# Altium project PowerBoard.PrjPcb (part 2 of 2)

## Sheet ESC_B.SchDoc
size A3; SheetNumber: 8; SheetTotal: 10
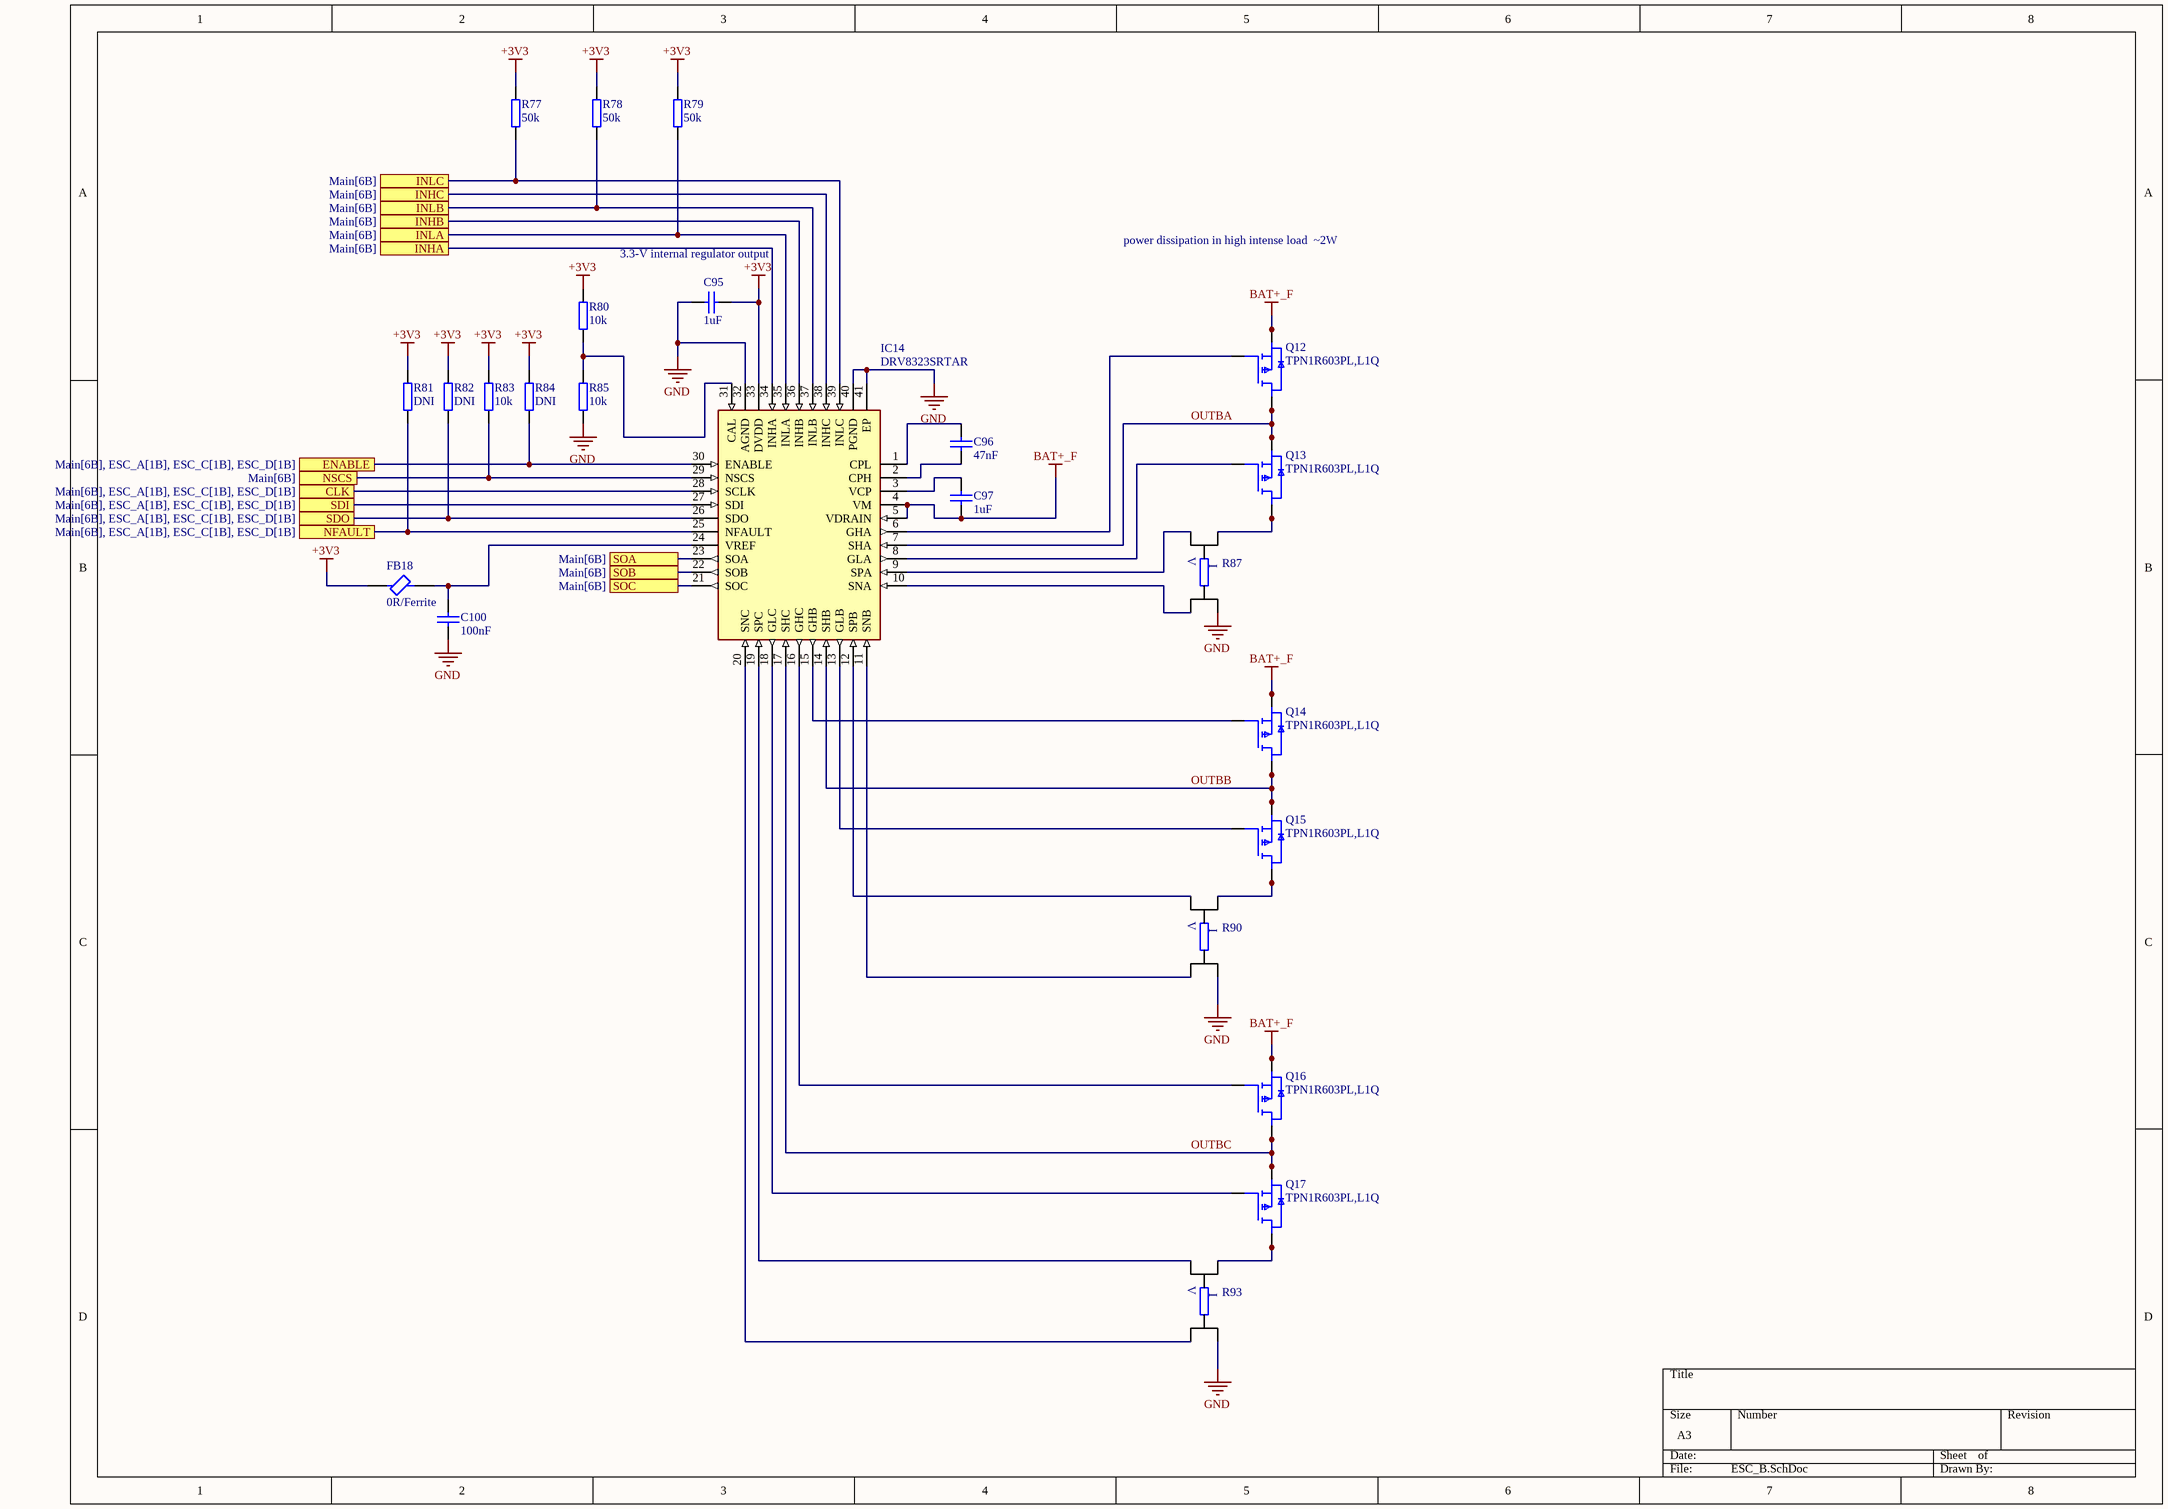
[diagram p8: ESC_B.SchDoc]

### Parts
C95  value 1uF  [CAP0402]  (hidden comment: Cap0402)
C96  value 47nF  [CAP0603]  (hidden comment: CapSMD0603)
C97  value 1uF  [CAP0603]  (hidden comment: CapSMD0603)
C100  value 100nF  [CAP0402]  (hidden comment: Cap0402)
FB18  0R/Ferrite  [NFZ15SG152SN10B]
IC14  DRV8323SRTAR  [QFN50P600X600X80-41N-D]
Q12  TPN1R603PL,L1Q  [TPN1R603PLL1Q]
Q13  TPN1R603PL,L1Q  [TPN1R603PLL1Q]
Q14  TPN1R603PL,L1Q  [TPN1R603PLL1Q]
Q15  TPN1R603PL,L1Q  [TPN1R603PLL1Q]
Q16  TPN1R603PL,L1Q  [TPN1R603PLL1Q]
Q17  TPN1R603PL,L1Q  [TPN1R603PLL1Q]
R77  value 50k  [RES0402]  (hidden comment: Res0402)
R78  value 50k  [RES0402]  (hidden comment: Res0402)
R79  value 50k  [RES0402]  (hidden comment: Res0402)
R80  value 10k  [RES0402]  (hidden comment: Res0402)
R81  value DNI  [RES0402]  (hidden comment: Res0402)
R82  value DNI  [RES0402]  (hidden comment: Res0402)
R83  value 10k  [RES0402]  (hidden comment: Res0402)
R84  value DNI  [RES0402]  (hidden comment: Res0402)
R85  value 10k  [RES0402]  (hidden comment: Res0402)
R87  WSK12161L000FEA  [WSK12161L000FEA]  (value not drawn)
R90  WSK12161L000FEA  [WSK12161L000FEA]  (value not drawn)
R93  WSK12161L000FEA  [WSK12161L000FEA]  (value not drawn)

### Ports
CLK (see Main[6B], ESC_A[1B], ESC_C[1B], ESC_D[1B]), ENABLE (see Main[6B], ESC_A[1B], ESC_C[1B], ESC_D[1B]), INHA (see Main[6B]), INHB (see Main[6B]), INHC (see Main[6B]), INLA (see Main[6B]), INLB (see Main[6B]), INLC (see Main[6B]), NFAULT (see Main[6B], ESC_A[1B], ESC_C[1B], ESC_D[1B]), NSCS (see Main[6B]), SDI (see Main[6B], ESC_A[1B], ESC_C[1B], ESC_D[1B]), SDO (see Main[6B], ESC_A[1B], ESC_C[1B], ESC_D[1B]), SOA (see Main[6B]), SOB (see Main[6B]), SOC (see Main[6B])

### Nets
+3V3: C95.2 FB18.1 IC14.33(DVDD) R77.2 R78.2 R79.2 R80.2 R81.2 R82.2 R83.2 R84.2
BAT+_F: C97.1 IC14.4(VM) IC14.5(VDRAIN) Q12.1(S_1) Q12.2(S_2) Q12.3(S_3) Q14.1(S_1) Q14.2(S_2) Q14.3(S_3) Q16.1(S_1) Q16.2(S_2) Q16.3(S_3)
GND: C95.1 C100.1 IC14.32(AGND) IC14.40(PGND) IC14.41(EP) R85.1 R87.4 R90.4 R93.4
ESC_CLK: IC14.28(SCLK) ; port CLK
ESC_ENABLE: IC14.30(ENABLE) R84.1 ; port ENABLE
ESC_INHA_B: IC14.34(INHA) ; port INHA
ESC_INHB_B: IC14.36(INHB) ; port INHB
ESC_INHC_B: IC14.38(INHC) ; port INHC
ESC_INLA_B: IC14.35(INLA) R79.1 ; port INLA
ESC_INLB_B: IC14.37(INLB) R78.1 ; port INLB
ESC_INLC_B: IC14.39(INLC) R77.1 ; port INLC
ESC_NFAULT: IC14.25(NFAULT) R81.1 ; port NFAULT
ESC_NSCS_B: IC14.29(NSCS) R83.1 ; port NSCS
ESC_SDI: IC14.27(SDI) ; port SDI
ESC_SDO: IC14.26(SDO) R82.1 ; port SDO
ESC_SOA_B: IC14.23(SOA) ; port SOA
ESC_SOB_B: IC14.22(SOB) ; port SOB
ESC_SOC_B: IC14.21(SOC) ; port SOC
OUTBA: IC14.7(SHA) Q12.5(D_1) Q12.6(D_2) Q12.7(D_3) Q12.8(D_4) Q12.9(D_4) Q13.1(S_1) Q13.2(S_2) Q13.3(S_3)
OUTBB: IC14.14(SHB) Q14.5(D_1) Q14.6(D_2) Q14.7(D_3) Q14.8(D_4) Q14.9(D_4) Q15.1(S_1) Q15.2(S_2) Q15.3(S_3)
OUTBC: IC14.17(SHC) Q16.5(D_1) Q16.6(D_2) Q16.7(D_3) Q16.8(D_4) Q16.9(D_4) Q17.1(S_1) Q17.2(S_2) Q17.3(S_3)
NetC96_1: C96.1 IC14.2(CPH)
NetC96_2: C96.2 IC14.1(CPL)
NetC97_2: C97.2 IC14.3(VCP)
NetC100_2: C100.2 FB18.2 IC14.24(VREF)
NetIC14_6: IC14.6(GHA) Q12.4(G)
NetIC14_8: IC14.8(GLA) Q13.4(G)
NetIC14_9: IC14.9(SPA) R87.2
NetIC14_10: IC14.10(SNA) R87.3
NetIC14_11: IC14.11(SNB) R90.3
NetIC14_12: IC14.12(SPB) R90.2
NetIC14_13: IC14.13(GLB) Q15.4(G)
NetIC14_15: IC14.15(GHB) Q14.4(G)
NetIC14_16: IC14.16(GHC) Q16.4(G)
NetIC14_18: IC14.18(GLC) Q17.4(G)
NetIC14_19: IC14.19(SPC) R93.2
NetIC14_20: IC14.20(SNC) R93.3
NetIC14_31: IC14.31(CAL) R80.1 R85.2
NetQ13_5: Q13.5(D_1) Q13.6(D_2) Q13.7(D_3) Q13.8(D_4) Q13.9(D_4) R87.1
NetQ15_5: Q15.5(D_1) Q15.6(D_2) Q15.7(D_3) Q15.8(D_4) Q15.9(D_4) R90.1
NetQ17_5: Q17.5(D_1) Q17.6(D_2) Q17.7(D_3) Q17.8(D_4) Q17.9(D_4) R93.1

### Notes on the sheet
- power dissipation in high intense load  ~2W
- 3.3-V internal regulator output
- (near IC14) Separate grounds?
- (in symbol WSK1216L5000FEA) V; I

### Library data of the parts
C95 = Cap0402: Voltage: val
C96 C97 = CapSMD0603: 50V; Published: 8-Jun-2000; LatestRevisionDate: 29-May-2009; LatestRevisionNote: IPC-7351 Footprint Added.; PackageReference: C1206; Publisher: Altium Limited; PackageDescription: Chip Capacitor
C100 = Cap0402: Voltage: 6V3
FB18 = BLM15PE471SH1D: as FB1 on sheet ADC+Temp; Datasheet Link: https://www.murata.com/en-global/products/productdetail.aspx?cate=luNoiseSupprFilteChipFerriBead&partno=BLM15PE471SH1%23; Height: 0.55mm; Manufacturer_Part_Number: BLM15PE471SH1D; Mouser Part Number: 81-BLM15PE471SH1D; Mouser Price/Stock: https://www.mouser.co.uk/ProductDetail/Murata-Electronics/BLM15PE471SH1D?qs=DRkmTr78QATAY5qAVx1hGA%3D%3D
IC14 = DRV8323SRTAR: as IC9 on sheet ESC_A; Datasheet Link: http://www.ti.com/lit/ds/symlink/drv8323.pdf; Height: 0.8mm; Manufacturer_Part_Number: DRV8323SRTAR; Mouser Part Number: 595-DRV8323SRTAR; Mouser Price/Stock: https://www.mouser.co.uk/ProductDetail/Texas-Instruments/DRV8323SRTAR?qs=u4fy%2FsgLU9P2gpPTX6mffg%3D%3D; Arrow Part Number: DRV8323SRTAR; Arrow Price/Stock: https://www.arrow.com/en/products/drv8323srtar/texas-instruments?utm_currency=USD&region=nac
Q12-Q17 = TPN1R603PL,L1Q: as Q6 on sheet ESC_A; Datasheet Link: https://toshiba.semicon-storage.com/ap-en/semiconductor/product/mosfets/12v-300v-mosfets/detail.TPN1R603PL.html; Height: 0.9mm; Manufacturer_Part_Number: TPN1R603PL,L1Q; Mouser Part Number: 757-TPN1R603PLL1Q; Mouser Price/Stock: https://www.mouser.co.uk/ProductDetail/Toshiba/TPN1R603PLL1Q?qs=bUPhaerQQeGYpGlYi%252BLguw%3D%3D; Arrow Part Number: TPN1R603PL,L1Q; Arrow Price/Stock: https://www.arrow.com/en/products/tpn1r603pll1q/toshiba?utm_currency=USD&region=nac
R87 R90 R93 = WSK1216L5000FEA: Resistor; Manufacturer_Name: Vishay; Datasheet Link: http://www.vishay.com/docs/30189/wsk1216.pdf; Height: 1.9mm; Manufacturer_Part_Number: WSK1216L5000FEA; Mouser Part Number: 71-WSK1216L5000FEA; Mouser Price/Stock: https://www.mouser.co.uk/ProductDetail/Vishay-Dale/WSK1216L5000FEA?qs=OlC7AqGiEDlM2wGD42LFoQ%3D%3D; Arrow Part Number: WSK1216L5000FEA; Arrow Price/Stock: https://www.arrow.com/en/products/wsk1216l5000fea/vishay?region=nac

## Sheet ESC_C.SchDoc
size A3; SheetNumber: 9; SheetTotal: 10
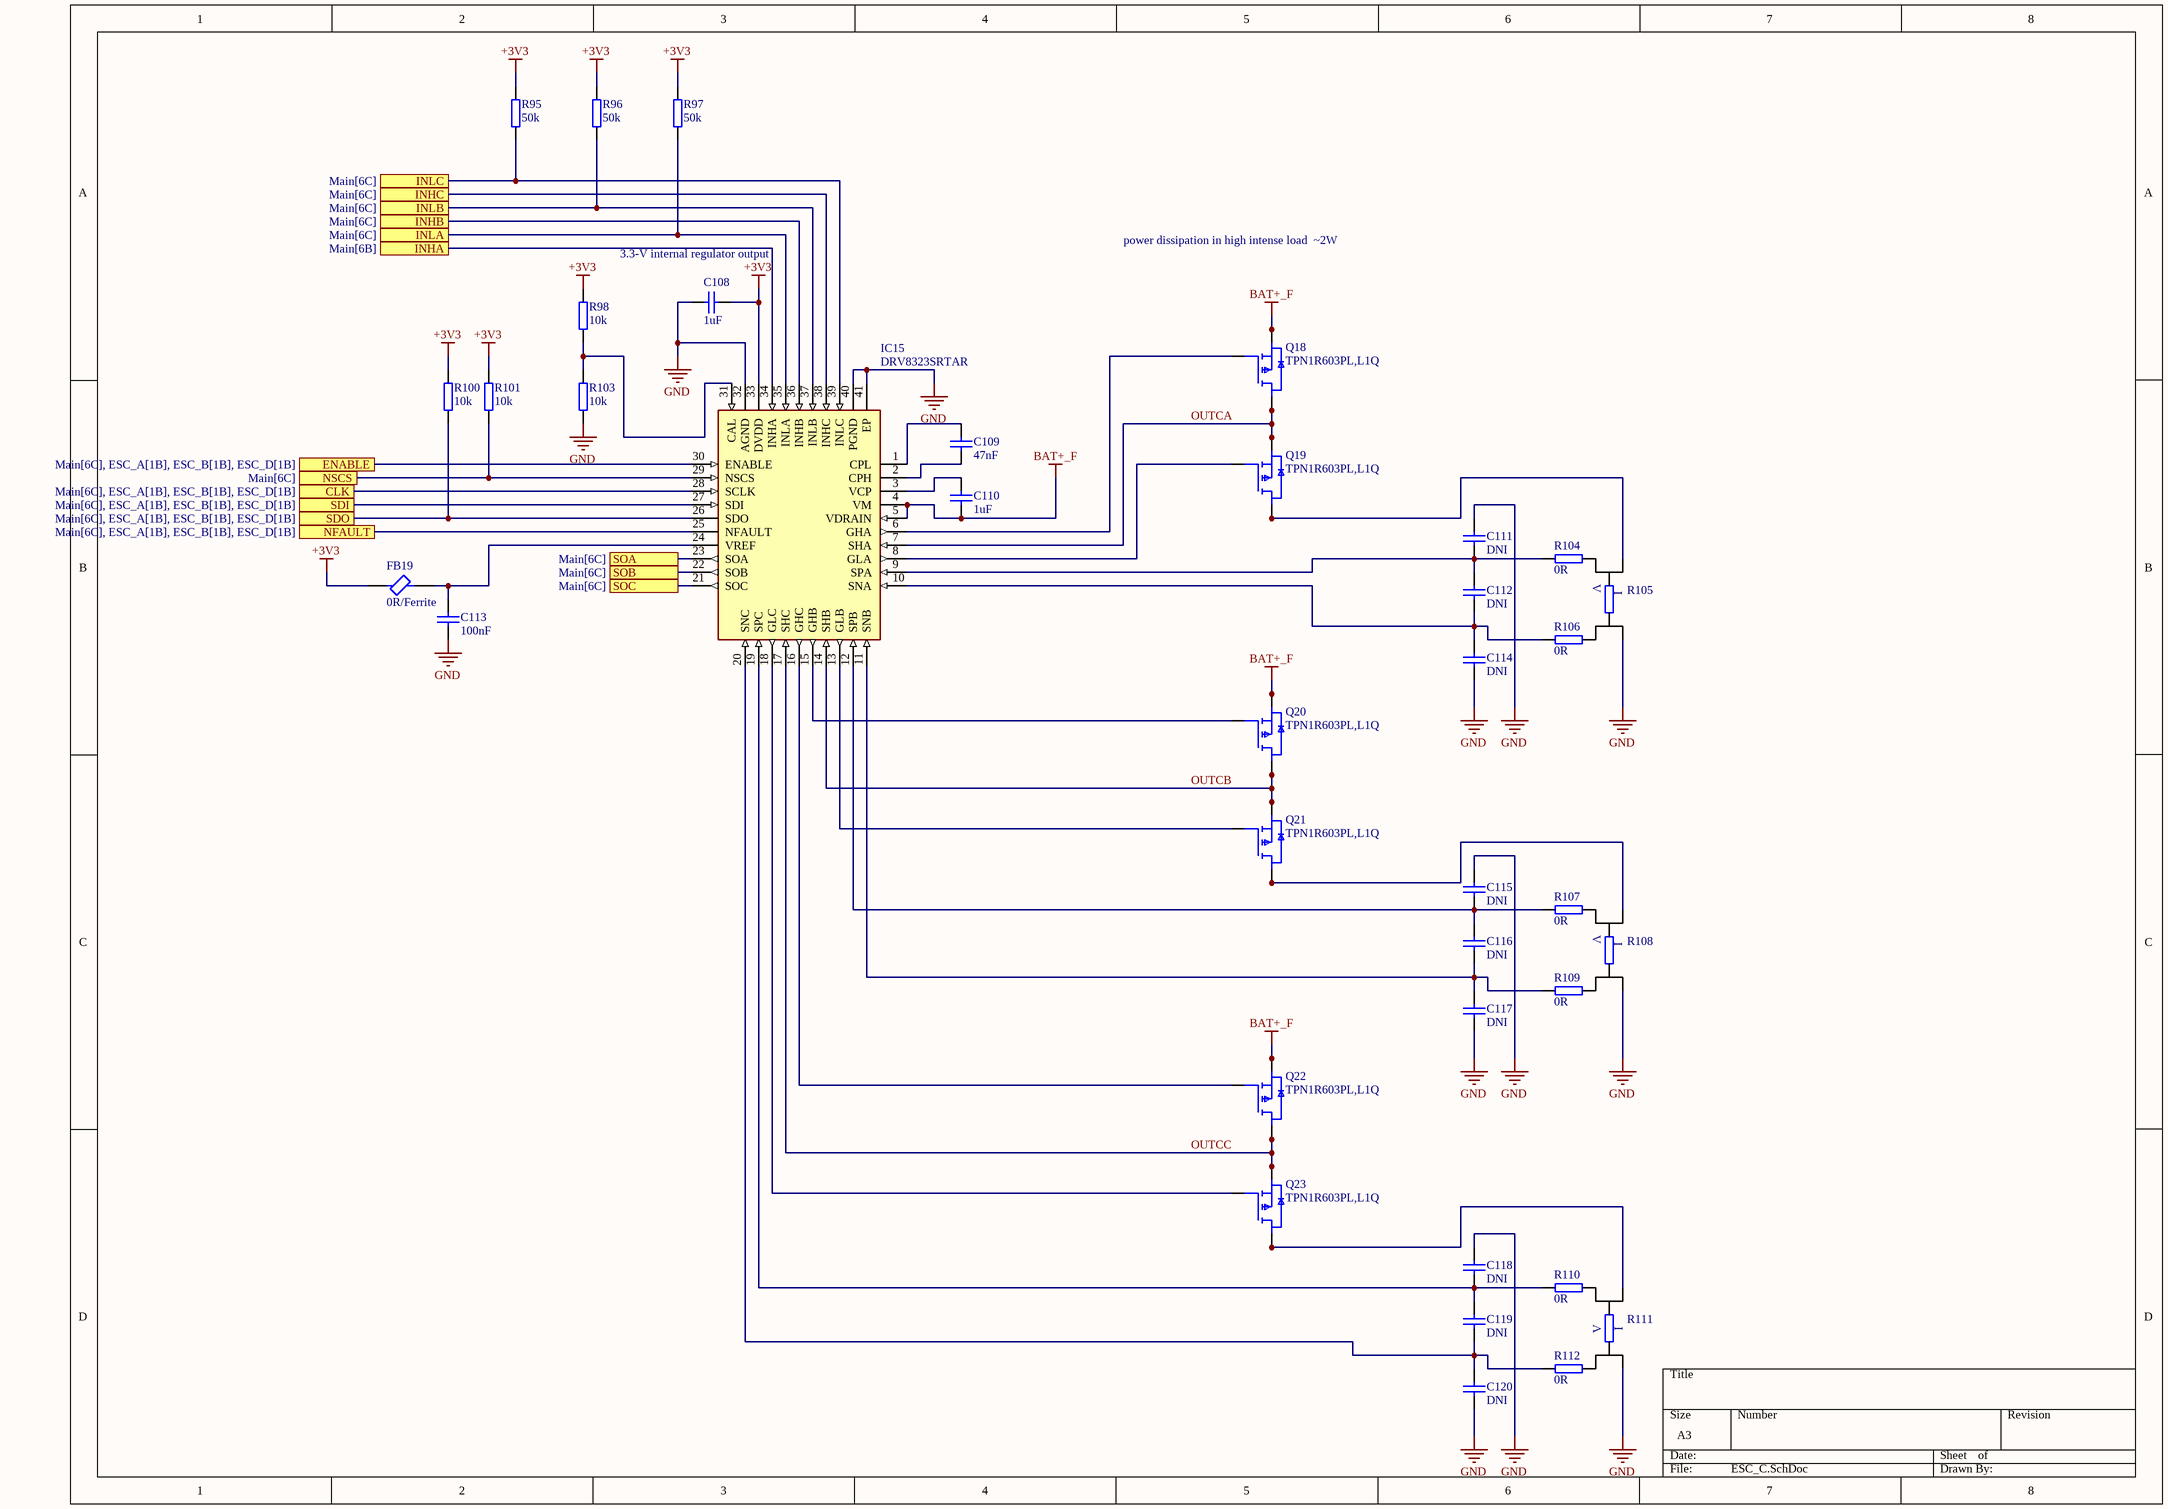
[diagram p9: ESC_C.SchDoc]

### Parts
C108  value 1uF  [CAP0402]  (hidden comment: Cap0402)
C109  value 47nF  [CAP0603]  (hidden comment: CapSMD0603)
C110  value 1uF  [CAP0603]  (hidden comment: CapSMD0603)
C111  value DNI  [CAP0402]  (hidden comment: Cap0402)
C112  value DNI  [CAP0402]  (hidden comment: Cap0402)
C113  value 100nF  [CAP0402]  (hidden comment: Cap0402)
C114  value DNI  [CAP0402]  (hidden comment: Cap0402)
C115  value DNI  [CAP0402]  (hidden comment: Cap0402)
C116  value DNI  [CAP0402]  (hidden comment: Cap0402)
C117  value DNI  [CAP0402]  (hidden comment: Cap0402)
C118  value DNI  [CAP0402]  (hidden comment: Cap0402)
C119  value DNI  [CAP0402]  (hidden comment: Cap0402)
C120  value DNI  [CAP0402]  (hidden comment: Cap0402)
FB19  0R/Ferrite  [NFZ15SG152SN10B]
IC15  DRV8323SRTAR  [QFN50P600X600X80-41N-D]
Q18  TPN1R603PL,L1Q  [TPN1R603PLL1Q]
Q19  TPN1R603PL,L1Q  [TPN1R603PLL1Q]
Q20  TPN1R603PL,L1Q  [TPN1R603PLL1Q]
Q21  TPN1R603PL,L1Q  [TPN1R603PLL1Q]
Q22  TPN1R603PL,L1Q  [TPN1R603PLL1Q]
Q23  TPN1R603PL,L1Q  [TPN1R603PLL1Q]
R95  value 50k  [RES0402]  (hidden comment: Res0402)
R96  value 50k  [RES0402]  (hidden comment: Res0402)
R97  value 50k  [RES0402]  (hidden comment: Res0402)
R98  value 10k  [RES0402]  (hidden comment: Res0402)
R100  value 10k  [RES0402]  (hidden comment: Res0402)
R101  value 10k  [RES0402]  (hidden comment: Res0402)
R103  value 10k  [RES0402]  (hidden comment: Res0402)
R104  value 0R  [RES0402]  (hidden comment: Res0402)
R105  WSK12161L000FEA  [WSK12161L000FEA]  (value not drawn)
R106  value 0R  [RES0402]  (hidden comment: Res0402)
R107  value 0R  [RES0402]  (hidden comment: Res0402)
R108  WSK12161L000FEA  [WSK12161L000FEA]  (value not drawn)
R109  value 0R  [RES0402]  (hidden comment: Res0402)
R110  value 0R  [RES0402]  (hidden comment: Res0402)
R111  WSK12161L000FEA  [WSK12161L000FEA]  (value not drawn)
R112  value 0R  [RES0402]  (hidden comment: Res0402)

### Ports
CLK (see Main[6C], ESC_A[1B], ESC_B[1B], ESC_D[1B]), ENABLE (see Main[6C], ESC_A[1B], ESC_B[1B], ESC_D[1B]), INHA (see Main[6B]), INHB (see Main[6C]), INHC (see Main[6C]), INLA (see Main[6C]), INLB (see Main[6C]), INLC (see Main[6C]), NFAULT (see Main[6C], ESC_A[1B], ESC_B[1B], ESC_D[1B]), NSCS (see Main[6C]), SDI (see Main[6C], ESC_A[1B], ESC_B[1B], ESC_D[1B]), SDO (see Main[6C], ESC_A[1B], ESC_B[1B], ESC_D[1B]), SOA (see Main[6C]), SOB (see Main[6C]), SOC (see Main[6C])

### Nets
+3V3: C108.2 FB19.1 IC15.33(DVDD) R95.2 R96.2 R97.2 R98.2 R100.2 R101.2
BAT+_F: C110.1 IC15.4(VM) IC15.5(VDRAIN) Q18.1(S_1) Q18.2(S_2) Q18.3(S_3) Q20.1(S_1) Q20.2(S_2) Q20.3(S_3) Q22.1(S_1) Q22.2(S_2) Q22.3(S_3)
GND: C108.1 C111.1 C113.1 C114.2 C115.1 C117.2 C118.1 C120.2 IC15.32(AGND) IC15.40(PGND) IC15.41(EP) R103.1 R105.4 R108.4 R111.1
ESC_CLK: IC15.28(SCLK) ; port CLK
ESC_ENABLE: IC15.30(ENABLE) ; port ENABLE
ESC_INHA_C: IC15.34(INHA) ; port INHA
ESC_INHB_C: IC15.36(INHB) ; port INHB
ESC_INHC_C: IC15.38(INHC) ; port INHC
ESC_INLA_C: IC15.35(INLA) R97.1 ; port INLA
ESC_INLB_C: IC15.37(INLB) R96.1 ; port INLB
ESC_INLC_C: IC15.39(INLC) R95.1 ; port INLC
ESC_NFAULT: IC15.25(NFAULT) ; port NFAULT
ESC_NSCS_C: IC15.29(NSCS) R101.1 ; port NSCS
ESC_SDI: IC15.27(SDI) ; port SDI
ESC_SDO: IC15.26(SDO) R100.1 ; port SDO
ESC_SOA_C: IC15.23(SOA) ; port SOA
ESC_SOB_C: IC15.22(SOB) ; port SOB
ESC_SOC_C: IC15.21(SOC) ; port SOC
OUTCA: IC15.7(SHA) Q18.5(D_1) Q18.6(D_2) Q18.7(D_3) Q18.8(D_4) Q18.9(D_4) Q19.1(S_1) Q19.2(S_2) Q19.3(S_3)
OUTCB: IC15.14(SHB) Q20.5(D_1) Q20.6(D_2) Q20.7(D_3) Q20.8(D_4) Q20.9(D_4) Q21.1(S_1) Q21.2(S_2) Q21.3(S_3)
OUTCC: IC15.17(SHC) Q22.5(D_1) Q22.6(D_2) Q22.7(D_3) Q22.8(D_4) Q22.9(D_4) Q23.1(S_1) Q23.2(S_2) Q23.3(S_3)
NetC109_1: C109.1 IC15.2(CPH)
NetC109_2: C109.2 IC15.1(CPL)
NetC110_2: C110.2 IC15.3(VCP)
NetC111_2: C111.2 C112.1 IC15.9(SPA) R104.1
NetC112_2: C112.2 C114.1 IC15.10(SNA) R106.1
NetC113_2: C113.2 FB19.2 IC15.24(VREF)
NetC115_2: C115.2 C116.1 IC15.12(SPB) R107.1
NetC116_2: C116.2 C117.1 IC15.11(SNB) R109.1
NetC118_2: C118.2 C119.1 IC15.19(SPC) R110.1
NetC119_2: C119.2 C120.1 IC15.20(SNC) R112.1
NetIC15_6: IC15.6(GHA) Q18.4(G)
NetIC15_8: IC15.8(GLA) Q19.4(G)
NetIC15_13: IC15.13(GLB) Q21.4(G)
NetIC15_15: IC15.15(GHB) Q20.4(G)
NetIC15_16: IC15.16(GHC) Q22.4(G)
NetIC15_18: IC15.18(GLC) Q23.4(G)
NetIC15_31: IC15.31(CAL) R98.1 R103.2
NetQ19_5: Q19.5(D_1) Q19.6(D_2) Q19.7(D_3) Q19.8(D_4) Q19.9(D_4) R105.1
NetQ21_5: Q21.5(D_1) Q21.6(D_2) Q21.7(D_3) Q21.8(D_4) Q21.9(D_4) R108.1
NetQ23_5: Q23.5(D_1) Q23.6(D_2) Q23.7(D_3) Q23.8(D_4) Q23.9(D_4) R111.4
NetR104_2: R104.2 R105.2
NetR105_3: R105.3 R106.2
NetR107_2: R107.2 R108.2
NetR108_3: R108.3 R109.2
NetR110_2: R110.2 R111.3
NetR111_2: R111.2 R112.2

### Notes on the sheet
- power dissipation in high intense load  ~2W
- 3.3-V internal regulator output
- (near IC15) Separate grounds?
- (in symbol WSK1216L5000FEA) V; I

### Library data of the parts
C108 = Cap0402: Voltage: val
C109 C110 = CapSMD0603: 50V; Published: 8-Jun-2000; LatestRevisionDate: 29-May-2009; LatestRevisionNote: IPC-7351 Footprint Added.; PackageReference: C1206; Publisher: Altium Limited; PackageDescription: Chip Capacitor
C113 = Cap0402: Voltage: 6V3
FB19 = BLM15PE471SH1D: as FB1 on sheet ADC+Temp; Datasheet Link: https://www.murata.com/en-global/products/productdetail.aspx?cate=luNoiseSupprFilteChipFerriBead&partno=BLM15PE471SH1%23; Height: 0.55mm; Manufacturer_Part_Number: BLM15PE471SH1D; Mouser Part Number: 81-BLM15PE471SH1D; Mouser Price/Stock: https://www.mouser.co.uk/ProductDetail/Murata-Electronics/BLM15PE471SH1D?qs=DRkmTr78QATAY5qAVx1hGA%3D%3D
IC15 = DRV8323SRTAR: as IC9 on sheet ESC_A; Datasheet Link: http://www.ti.com/lit/ds/symlink/drv8323.pdf; Height: 0.8mm; Manufacturer_Part_Number: DRV8323SRTAR; Mouser Part Number: 595-DRV8323SRTAR; Mouser Price/Stock: https://www.mouser.co.uk/ProductDetail/Texas-Instruments/DRV8323SRTAR?qs=u4fy%2FsgLU9P2gpPTX6mffg%3D%3D; Arrow Part Number: DRV8323SRTAR; Arrow Price/Stock: https://www.arrow.com/en/products/drv8323srtar/texas-instruments?utm_currency=USD&region=nac
Q18-Q23 = TPN1R603PL,L1Q: as Q6 on sheet ESC_A; Datasheet Link: https://toshiba.semicon-storage.com/ap-en/semiconductor/product/mosfets/12v-300v-mosfets/detail.TPN1R603PL.html; Height: 0.9mm; Manufacturer_Part_Number: TPN1R603PL,L1Q; Mouser Part Number: 757-TPN1R603PLL1Q; Mouser Price/Stock: https://www.mouser.co.uk/ProductDetail/Toshiba/TPN1R603PLL1Q?qs=bUPhaerQQeGYpGlYi%252BLguw%3D%3D; Arrow Part Number: TPN1R603PL,L1Q; Arrow Price/Stock: https://www.arrow.com/en/products/tpn1r603pll1q/toshiba?utm_currency=USD&region=nac
R105 R108 R111 = WSK1216L5000FEA: Resistor; Manufacturer_Name: Vishay; Datasheet Link: http://www.vishay.com/docs/30189/wsk1216.pdf; Height: 1.9mm; Manufacturer_Part_Number: WSK1216L5000FEA; Mouser Part Number: 71-WSK1216L5000FEA; Mouser Price/Stock: https://www.mouser.co.uk/ProductDetail/Vishay-Dale/WSK1216L5000FEA?qs=OlC7AqGiEDlM2wGD42LFoQ%3D%3D; Arrow Part Number: WSK1216L5000FEA; Arrow Price/Stock: https://www.arrow.com/en/products/wsk1216l5000fea/vishay?region=nac
C111 C112 C114-C120 = Cap0402: Voltage: DNI

## Sheet ESC_D.SchDoc
size A3; SheetNumber: 10; SheetTotal: 10
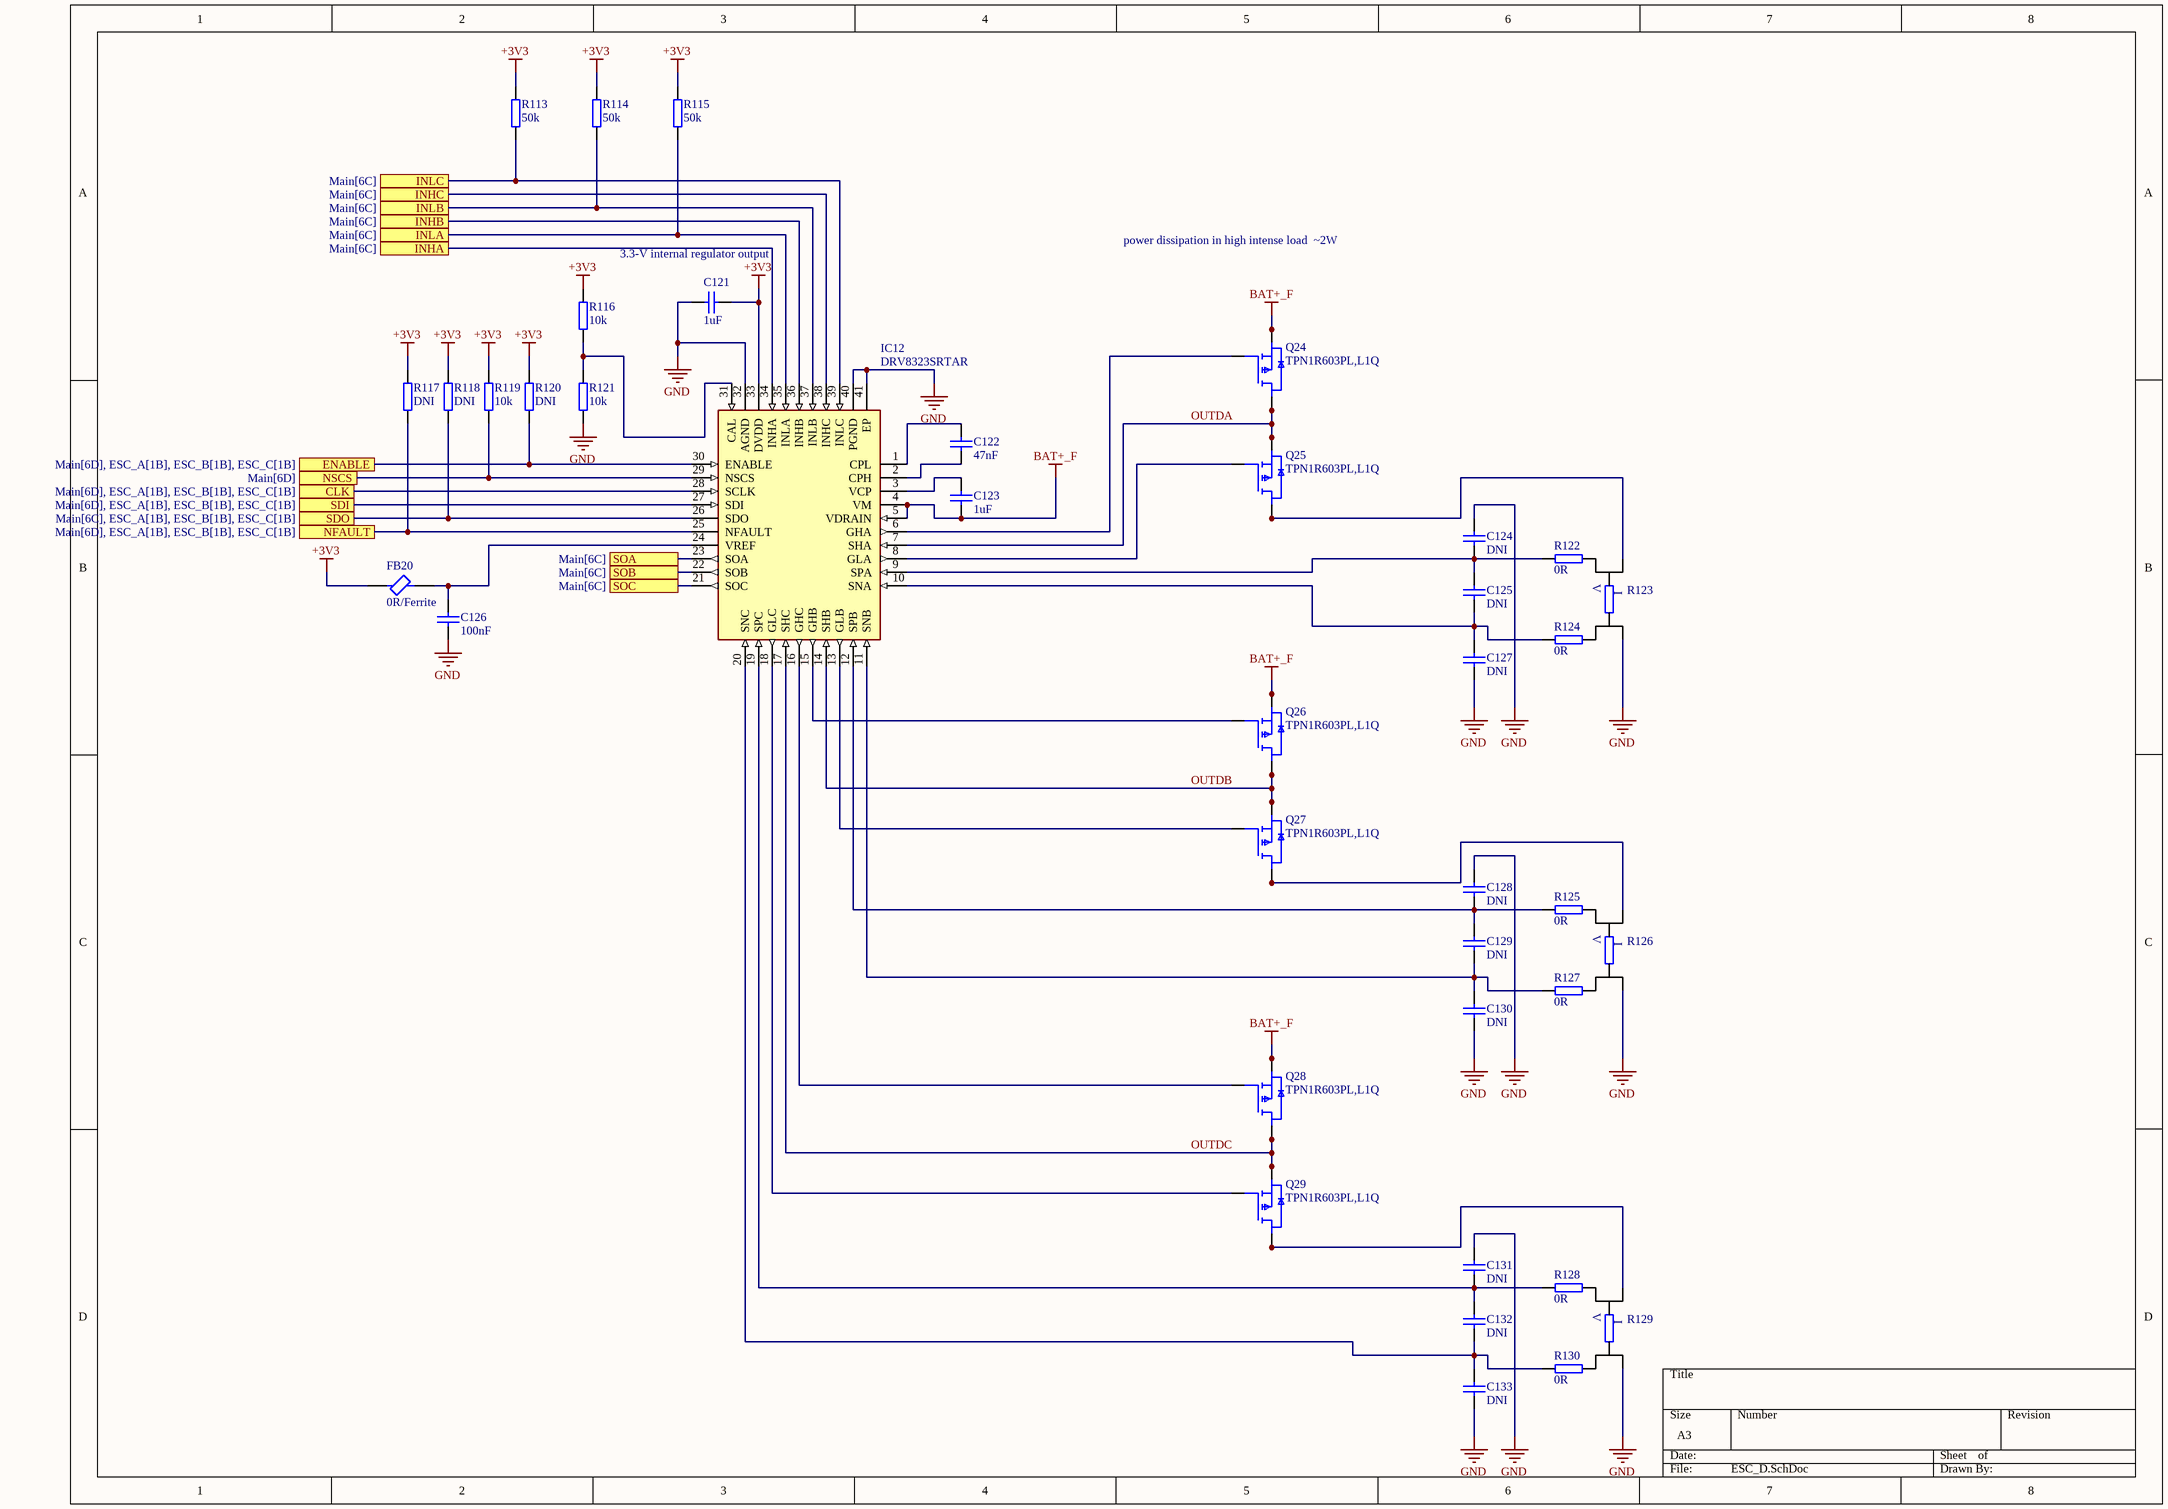
[diagram p10: ESC_D.SchDoc]

### Parts
(Parts that share a designator on the sheet are numbered #1, #2 ... from top to bottom, then left to right.)
C121  value 1uF  [CAP0402]  (hidden comment: Cap0402)
C122  value 47nF  [CAP0603]  (hidden comment: CapSMD0603)
C123  value 1uF  [CAP0603]  (hidden comment: CapSMD0603)
C124  value DNI  [CAP0402]  (hidden comment: Cap0402)
C125  value DNI  [CAP0402]  (hidden comment: Cap0402)
C126  value 100nF  [CAP0402]  (hidden comment: Cap0402)
C127  value DNI  [CAP0402]  (hidden comment: Cap0402)
C128  value DNI  [CAP0402]  (hidden comment: Cap0402)
C129  value DNI  [CAP0402]  (hidden comment: Cap0402)
C130  value DNI  [CAP0402]  (hidden comment: Cap0402)
C131  value DNI  [CAP0402]  (hidden comment: Cap0402)
C132  value DNI  [CAP0402]  (hidden comment: Cap0402)
C133  value DNI  [CAP0402]  (hidden comment: Cap0402)
FB20  0R/Ferrite  [NFZ15SG152SN10B]
IC12#2  DRV8323SRTAR  [QFN50P600X600X80-41N-D]
Q24  TPN1R603PL,L1Q  [TPN1R603PLL1Q]
Q25  TPN1R603PL,L1Q  [TPN1R603PLL1Q]
Q26  TPN1R603PL,L1Q  [TPN1R603PLL1Q]
Q27  TPN1R603PL,L1Q  [TPN1R603PLL1Q]
Q28  TPN1R603PL,L1Q  [TPN1R603PLL1Q]
Q29  TPN1R603PL,L1Q  [TPN1R603PLL1Q]
R113  value 50k  [RES0402]  (hidden comment: Res0402)
R114  value 50k  [RES0402]  (hidden comment: Res0402)
R115  value 50k  [RES0402]  (hidden comment: Res0402)
R116  value 10k  [RES0402]  (hidden comment: Res0402)
R117  value DNI  [RES0402]  (hidden comment: Res0402)
R118  value DNI  [RES0402]  (hidden comment: Res0402)
R119  value 10k  [RES0402]  (hidden comment: Res0402)
R120  value DNI  [RES0402]  (hidden comment: Res0402)
R121  value 10k  [RES0402]  (hidden comment: Res0402)
R122  value 0R  [RES0402]  (hidden comment: Res0402)
R123  WSK12161L000FEA  [WSK12161L000FEA]  (value not drawn)
R124  value 0R  [RES0402]  (hidden comment: Res0402)
R125  value 0R  [RES0402]  (hidden comment: Res0402)
R126  WSK12161L000FEA  [WSK12161L000FEA]  (value not drawn)
R127  value 0R  [RES0402]  (hidden comment: Res0402)
R128  value 0R  [RES0402]  (hidden comment: Res0402)
R129  WSK12161L000FEA  [WSK12161L000FEA]  (value not drawn)
R130  value 0R  [RES0402]  (hidden comment: Res0402)

### Ports
CLK (see Main[6D], ESC_A[1B], ESC_B[1B], ESC_C[1B]), ENABLE (see Main[6D], ESC_A[1B], ESC_B[1B], ESC_C[1B]), INHA (see Main[6C]), INHB (see Main[6C]), INHC (see Main[6C]), INLA (see Main[6C]), INLB (see Main[6C]), INLC (see Main[6C]), NFAULT (see Main[6D], ESC_A[1B], ESC_B[1B], ESC_C[1B]), NSCS (see Main[6D]), SDI (see Main[6D], ESC_A[1B], ESC_B[1B], ESC_C[1B]), SDO (see Main[6C], ESC_A[1B], ESC_B[1B], ESC_C[1B]), SOA (see Main[6C]), SOB (see Main[6C]), SOC (see Main[6C])

### Nets
+3V3: C121.2 FB20.1 IC12#2.33(DVDD) R113.2 R114.2 R115.2 R116.2 R117.2 R118.2 R119.2 R120.2
BAT+_F: C123.1 IC12#2.4(VM) IC12#2.5(VDRAIN) Q24.1(S_1) Q24.2(S_2) Q24.3(S_3) Q26.1(S_1) Q26.2(S_2) Q26.3(S_3) Q28.1(S_1) Q28.2(S_2) Q28.3(S_3)
GND: C121.1 C124.1 C126.1 C127.2 C128.1 C130.2 C131.1 C133.2 IC12#2.32(AGND) IC12#2.40(PGND) IC12#2.41(EP) R121.1 R123.4 R126.4 R129.4
ESC_CLK: IC12#2.28(SCLK) ; port CLK
ESC_ENABLE: IC12#2.30(ENABLE) R120.1 ; port ENABLE
ESC_INHA_D: IC12#2.34(INHA) ; port INHA
ESC_INHB_D: IC12#2.36(INHB) ; port INHB
ESC_INHC_D: IC12#2.38(INHC) ; port INHC
ESC_INLA_D: IC12#2.35(INLA) R115.1 ; port INLA
ESC_INLB_D: IC12#2.37(INLB) R114.1 ; port INLB
ESC_INLC_D: IC12#2.39(INLC) R113.1 ; port INLC
ESC_NFAULT: IC12#2.25(NFAULT) R117.1 ; port NFAULT
ESC_NSCS_D: IC12#2.29(NSCS) R119.1 ; port NSCS
ESC_SDI: IC12#2.27(SDI) ; port SDI
ESC_SDO: IC12#2.26(SDO) R118.1 ; port SDO
ESC_SOA_D: IC12#2.23(SOA) ; port SOA
ESC_SOB_D: IC12#2.22(SOB) ; port SOB
ESC_SOC_D: IC12#2.21(SOC) ; port SOC
OUTDA: IC12#2.7(SHA) Q24.5(D_1) Q24.6(D_2) Q24.7(D_3) Q24.8(D_4) Q24.9(D_4) Q25.1(S_1) Q25.2(S_2) Q25.3(S_3)
OUTDB: IC12#2.14(SHB) Q26.5(D_1) Q26.6(D_2) Q26.7(D_3) Q26.8(D_4) Q26.9(D_4) Q27.1(S_1) Q27.2(S_2) Q27.3(S_3)
OUTDC: IC12#2.17(SHC) Q28.5(D_1) Q28.6(D_2) Q28.7(D_3) Q28.8(D_4) Q28.9(D_4) Q29.1(S_1) Q29.2(S_2) Q29.3(S_3)
NetC122_1: C122.1 IC12#2.2(CPH)
NetC122_2: C122.2 IC12#2.1(CPL)
NetC123_2: C123.2 IC12#2.3(VCP)
NetC124_2: C124.2 C125.1 IC12#2.9(SPA) R122.1
NetC125_2: C125.2 C127.1 IC12#2.10(SNA) R124.1
NetC126_2: C126.2 FB20.2 IC12#2.24(VREF)
NetC128_2: C128.2 C129.1 IC12#2.12(SPB) R125.1
NetC129_2: C129.2 C130.1 IC12#2.11(SNB) R127.1
NetC131_2: C131.2 C132.1 IC12#2.19(SPC) R128.1
NetC132_2: C132.2 C133.1 IC12#2.20(SNC) R130.1
NetIC12#2_6: IC12#2.6(GHA) Q24.4(G)
NetIC12#2_8: IC12#2.8(GLA) Q25.4(G)
NetIC12#2_13: IC12#2.13(GLB) Q27.4(G)
NetIC12#2_15: IC12#2.15(GHB) Q26.4(G)
NetIC12#2_16: IC12#2.16(GHC) Q28.4(G)
NetIC12#2_18: IC12#2.18(GLC) Q29.4(G)
NetIC12#2_31: IC12#2.31(CAL) R116.1 R121.2
NetQ25_5: Q25.5(D_1) Q25.6(D_2) Q25.7(D_3) Q25.8(D_4) Q25.9(D_4) R123.1
NetQ27_5: Q27.5(D_1) Q27.6(D_2) Q27.7(D_3) Q27.8(D_4) Q27.9(D_4) R126.1
NetQ29_5: Q29.5(D_1) Q29.6(D_2) Q29.7(D_3) Q29.8(D_4) Q29.9(D_4) R129.1
NetR122_2: R122.2 R123.2
NetR123_3: R123.3 R124.2
NetR125_2: R125.2 R126.2
NetR126_3: R126.3 R127.2
NetR128_2: R128.2 R129.2
NetR129_3: R129.3 R130.2

### Notes on the sheet
- power dissipation in high intense load  ~2W
- 3.3-V internal regulator output
- (near IC12#2) Separate grounds?
- (in symbol WSK1216L5000FEA) V; I

### Library data of the parts
C121 = Cap0402: Voltage: val
C122 C123 = CapSMD0603: 50V; Published: 8-Jun-2000; LatestRevisionDate: 29-May-2009; LatestRevisionNote: IPC-7351 Footprint Added.; PackageReference: C1206; Publisher: Altium Limited; PackageDescription: Chip Capacitor
C126 = Cap0402: Voltage: 6V3
FB20 = BLM15PE471SH1D: Ferrite Bead; Manufacturer_Name: Murata Electronics; Datasheet Link: https://www.murata.com/en-global/products/productdetail.aspx?cate=luNoiseSupprFilteChipFerriBead&partno=BLM15PE471SH1%23; Height: 0.55mm; Manufacturer_Part_Number: BLM15PE471SH1D; Mouser Part Number: 81-BLM15PE471SH1D; Mouser Price/Stock: https://www.mouser.co.uk/ProductDetail/Murata-Electronics/BLM15PE471SH1D?qs=DRkmTr78QATAY5qAVx1hGA%3D%3D
IC12#2 = DRV8323SRTAR: Integrated Circuit; Manufacturer_Name: Texas Instruments; Datasheet Link: http://www.ti.com/lit/ds/symlink/drv8323.pdf; Height: 0.8mm; Manufacturer_Part_Number: DRV8323SRTAR; Mouser Part Number: 595-DRV8323SRTAR; Mouser Price/Stock: https://www.mouser.co.uk/ProductDetail/Texas-Instruments/DRV8323SRTAR?qs=u4fy%2FsgLU9P2gpPTX6mffg%3D%3D; Arrow Part Number: DRV8323SRTAR; Arrow Price/Stock: https://www.arrow.com/en/products/drv8323srtar/texas-instruments?utm_currency=USD&region=nac
Q24-Q29 = TPN1R603PL,L1Q: MOSFET (N-Channel); Manufacturer_Name: Toshiba; Datasheet Link: https://toshiba.semicon-storage.com/ap-en/semiconductor/product/mosfets/12v-300v-mosfets/detail.TPN1R603PL.html; Height: 0.9mm; Manufacturer_Part_Number: TPN1R603PL,L1Q; Mouser Part Number: 757-TPN1R603PLL1Q; Mouser Price/Stock: https://www.mouser.co.uk/ProductDetail/Toshiba/TPN1R603PLL1Q?qs=bUPhaerQQeGYpGlYi%252BLguw%3D%3D; Arrow Part Number: TPN1R603PL,L1Q; Arrow Price/Stock: https://www.arrow.com/en/products/tpn1r603pll1q/toshiba?utm_currency=USD&region=nac
R123 R126 R129 = WSK1216L5000FEA: Resistor; Manufacturer_Name: Vishay; Datasheet Link: http://www.vishay.com/docs/30189/wsk1216.pdf; Height: 1.9mm; Manufacturer_Part_Number: WSK1216L5000FEA; Mouser Part Number: 71-WSK1216L5000FEA; Mouser Price/Stock: https://www.mouser.co.uk/ProductDetail/Vishay-Dale/WSK1216L5000FEA?qs=OlC7AqGiEDlM2wGD42LFoQ%3D%3D; Arrow Part Number: WSK1216L5000FEA; Arrow Price/Stock: https://www.arrow.com/en/products/wsk1216l5000fea/vishay?region=nac
C124 C125 C127-C133 = Cap0402: Voltage: DNI

## Nets that join several sheets
+3V3: BMS (7 pins), USB (9 pins), ADC+Temp (17 pins), ToF_Bottom (9 pins), FC_Conn (D13.1 R58.2), ESC_A (11 pins), ESC_B (11 pins), ESC_C (9 pins), ESC_D (11 pins)
BAT+_F: Main (C53.1 C54.1), BMS (8 pins), ADC+Temp (R51.2), ESC_A (12 pins), ESC_B (12 pins), ESC_C (12 pins), ESC_D (12 pins)
GND: Main (C53.2 C54.2), BMS (52 pins), USB (26 pins), ADC+Temp (42 pins), ToF_Bottom (8 pins), FC_Conn (11 pins), ESC_A (15 pins), ESC_B (9 pins), ESC_C (15 pins), ESC_D (15 pins)
BMS_CHRG_OK: BMS (IC1.4 R11.1), FC_Conn (D7.9 J3.10)
BMS_OTG/VAP: BMS (IC1.5), FC_Conn (D7.2 J3.11)
BMS_PROCHOT: BMS (IC1.11 R19.1), FC_Conn (D6.1 J3.1)
CB_ALERT: BMS (IC2.20 R32.2), FC_Conn (D7.1 J3.9)
D_N: USB (R40.2), FC_Conn (D11.1 J3.41)
D_P: USB (R39.2), FC_Conn (D12.1 J3.42)
ESC_CLK: FC_Conn (D10.6 J3.39), ESC_A (IC9.28), ESC_B (IC14.28), ESC_C (IC15.28), ESC_D (IC12#2.28)
ESC_ENABLE: FC_Conn (D10.5 J3.40), ESC_A (IC9.30 R66.1), ESC_B (IC14.30 R84.1), ESC_C (IC15.30), ESC_D (IC12#2.30 R120.1)
ESC_INHA_A: FC_Conn (D7.6 J3.15), ESC_A (IC9.34)
ESC_INHA_B: FC_Conn (D6.6 J3.7), ESC_B (IC14.34)
ESC_INHA_C: FC_Conn (D9.2 J3.27), ESC_C (IC15.34)
ESC_INHA_D: FC_Conn (D10.9 J3.34), ESC_D (IC12#2.34)
ESC_INHB_A: FC_Conn (D8.1 J3.17), ESC_A (IC9.36)
ESC_INHB_B: FC_Conn (D6.7 J3.5), ESC_B (IC14.36)
ESC_INHB_C: FC_Conn (D9.1 J3.25), ESC_C (IC15.36)
ESC_INHB_D: FC_Conn (D9.5 J3.32), ESC_D (IC12#2.36)
ESC_INHC_A: FC_Conn (D8.2 J3.19), ESC_A (IC9.38)
ESC_INHC_B: FC_Conn (D6.2 J3.3), ESC_B (IC14.38)
ESC_INHC_C: FC_Conn (D8.6 J3.23), ESC_C (IC15.38)
ESC_INHC_D: FC_Conn (D9.4 J3.30), ESC_D (IC12#2.38)
ESC_INLA_A: FC_Conn (D7.5 J3.16), ESC_A (IC9.35 R61.1)
ESC_INLA_B: FC_Conn (D6.4 J3.6), ESC_B (IC14.35 R79.1)
ESC_INLA_C: FC_Conn (D9.9 J3.26), ESC_C (IC15.35 R97.1)
ESC_INLA_D: FC_Conn (D10.1 J3.33), ESC_D (IC12#2.35 R115.1)
ESC_INLB_A: FC_Conn (D8.9 J3.18), ESC_A (IC9.37 R60.1)
ESC_INLB_B: FC_Conn (D6.8 J3.4), ESC_B (IC14.37 R78.1)
ESC_INLB_C: FC_Conn (D8.5 J3.24), ESC_C (IC15.37 R96.1)
ESC_INLB_D: FC_Conn (D9.6 J3.31), ESC_D (IC12#2.37 R114.1)
ESC_INLC_A: FC_Conn (D8.8 J3.20), ESC_A (IC9.39 R59.1)
ESC_INLC_B: FC_Conn (D6.9 J3.2), ESC_B (IC14.39 R77.1)
ESC_INLC_C: FC_Conn (D8.4 J3.22), ESC_C (IC15.39 R95.1)
ESC_INLC_D: FC_Conn (D9.7 J3.29), ESC_D (IC12#2.39 R113.1)
ESC_NFAULT: FC_Conn (D10.8 J3.36), ESC_A (IC9.25 R63.1), ESC_B (IC14.25 R81.1), ESC_C (IC15.25), ESC_D (IC12#2.25 R117.1)
ESC_NSCS_A: FC_Conn (D8.7 J3.21), ESC_A (IC9.29 R65.1)
ESC_NSCS_B: FC_Conn (D6.5 J3.8), ESC_B (IC14.29 R83.1)
ESC_NSCS_C: FC_Conn (D9.8 J3.28), ESC_C (IC15.29 R101.1)
ESC_NSCS_D: FC_Conn (D10.2 J3.35), ESC_D (IC12#2.29 R119.1)
ESC_SDI: FC_Conn (D10.4 J3.38), ESC_A (IC9.27), ESC_B (IC14.27), ESC_C (IC15.27), ESC_D (IC12#2.27)
ESC_SDO: FC_Conn (D10.7 J3.37), ESC_A (IC9.26 R64.1), ESC_B (IC14.26 R82.1), ESC_C (IC15.26 R100.1), ESC_D (IC12#2.26 R118.1)
ESC_SOA_A: ADC+Temp (FB5.1), ESC_A (IC9.23)
ESC_SOA_B: ADC+Temp (FB14.1), ESC_B (IC14.23)
ESC_SOA_C: ADC+Temp (FB11.1), ESC_C (IC15.23)
ESC_SOA_D: ADC+Temp (FB10.1), ESC_D (IC12#2.23)
ESC_SOB_A: ADC+Temp (FB3.1), ESC_A (IC9.22)
ESC_SOB_B: ADC+Temp (FB15.1), ESC_B (IC14.22)
ESC_SOB_C: ADC+Temp (FB12.1), ESC_C (IC15.22)
ESC_SOB_D: ADC+Temp (FB7.1), ESC_D (IC12#2.22)
ESC_SOC_A: ADC+Temp (FB1.1), ESC_A (IC9.21)
ESC_SOC_B: ADC+Temp (FB16.1), ESC_B (IC14.21)
ESC_SOC_C: ADC+Temp (FB13.1), ESC_C (IC15.21)
ESC_SOC_D: ADC+Temp (FB9.1), ESC_D (IC12#2.21)
SCL: BMS (IC1.13 IC2.5 R21.1 R27.1), USB (IC4.7 R37.1), ADC+Temp (IC5.2 R49.1), ToF_Bottom (IC12#1.5), FC_Conn (D7.8 J3.12)
SDA: BMS (IC1.12 IC2.4 R20.1 R28.1), USB (IC4.6 R36.1), ADC+Temp (IC5.3 R50.1), ToF_Bottom (IC12#1.6), FC_Conn (D7.7 J3.13)
TOF_INT: ToF_Bottom (IC12#1.4), FC_Conn (D7.4 J3.14)
VBUS: BMS (6 pins), USB (9 pins)
VSYS: BMS (17 pins), FC_Conn (D14.1 J3.46 J3.47)